# Altium schematic sheet 03_Incense_4G.SchDoc
size B; SheetNumber: 3
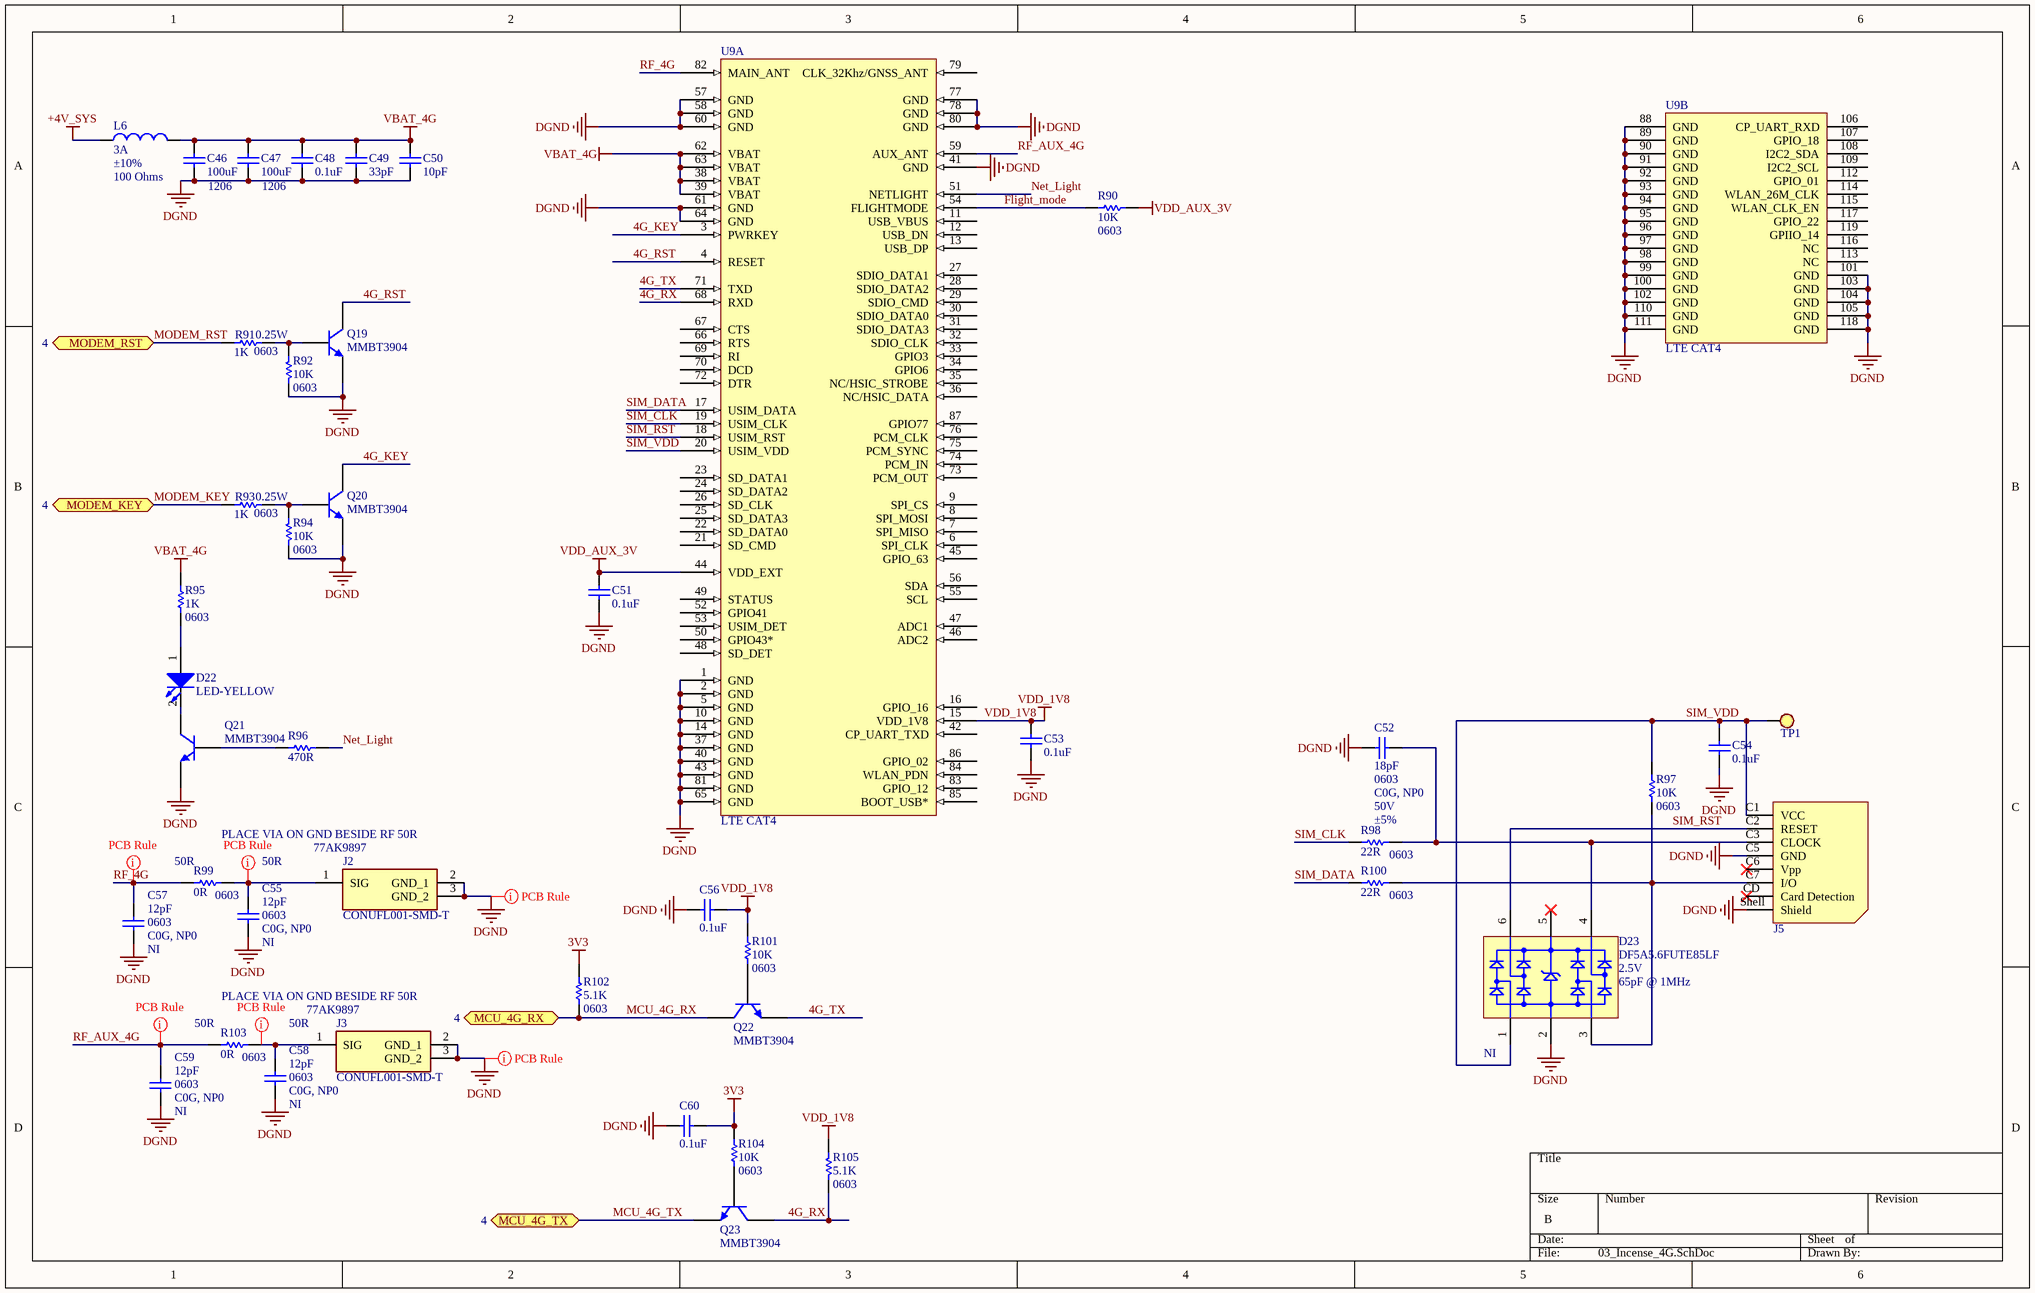
[diagram p0: 03_Incense_4G.SchDoc]

## Parts
C46  PCB FOOTPRINT: 1206  [CAP 1206]  (hidden comment: 100uF)
C47  PCB FOOTPRINT: 1206  [CAP 1206]  (hidden comment: 100uF)
C48  0.1uF  [CAP 0603]
C49  33pF  [CAP 0603]
C50  10pF  [CAP 0603]
C51  0.1uF  [CAP 0603]
C52  FOOTPRINT: 0603  Material: C0G, NP0  Voltage: 50V  Tolerance: ±5%  [CAP 0603]  (hidden comment: 18pF)
C53  0.1uF  [CAP 0603]
C54  0.1uF  [CAP 0603]
C55  value 12pF  FOOTPRINT: 0603  Material: C0G, NP0  [CAP 0603]  (hidden comment: NI)
C56  0.1uF  [CAP 0603]
C57  value 12pF  FOOTPRINT: 0603  Material: C0G, NP0  [CAP 0603]  (hidden comment: NI)
C58  value 12pF  FOOTPRINT: 0603  Material: C0G, NP0  [CAP 0603]  (hidden comment: NI)
C59  value 12pF  FOOTPRINT: 0603  Material: C0G, NP0  [CAP 0603]  (hidden comment: NI)
C60  0.1uF  [CAP 0603]
D22  LED-YELLOW  [LED 0603]
D23  DF5A5.6FUTE85LF  VOLTAGE: 2.5V  CAPACITANCE: 65pF @ 1MHz  NI_MARK: NI  [SC-70-6]
J2  CONUFL001-SMD-T  Supplier Part Number 1: 77AK9897  [CONUFL001-SMD]
J3  CONUFL001-SMD-T  Supplier Part Number 1: 77AK9897  [CONUFL001-SMD]
J5  693021020811  [693021020811]  (value not drawn)
L6  value 100 Ohms  Current: 3A  Tolerance: ±10%  [FB 0603]  (hidden comment: MPZ1608S101ATAH0)
Q19  MMBT3904  [SOT-23]
Q20  MMBT3904  [SOT-23]
Q21  MMBT3904  [SOT-23]
Q22  MMBT3904  [SOT-23]
Q23  MMBT3904  [SOT-23]
R90  PCB Footprint: 0603  [res 0603]  (hidden comment: 10K)
R91  PCB Footprint: 0603  Power: 0.25W  [res 0603]  (hidden comment: 1K)
R92  PCB Footprint: 0603  [res 0603]  (hidden comment: 10K)
R93  PCB Footprint: 0603  Power: 0.25W  [res 0603]  (hidden comment: 1K)
R94  PCB Footprint: 0603  [res 0603]  (hidden comment: 10K)
R95  PCB Footprint: 0603  [res 0603]  (hidden comment: 1K)
R96  470R  [res 0603]
R97  PCB Footprint: 0603  [res 0603]  (hidden comment: 10K)
R98  PCB Footprint: 0603  [res 0603]  (hidden comment: 22R)
R99  PCB Footprint: 0603  [res 0603]  (hidden comment: 0R)
R100  PCB Footprint: 0603  [res 0603]  (hidden comment: 22R)
R101  PCB Footprint: 0603  [res 0603]  (hidden comment: 10K)
R102  PCB Footprint: 0603  [res 0603]  (hidden comment: 5.1K)
R103  PCB Footprint: 0603  [res 0603]  (hidden comment: 0R)
R104  PCB Footprint: 0603  [res 0603]  (hidden comment: 10K)
R105  PCB Footprint: 0603  [res 0603]  (hidden comment: 5.1K)
TP1  TP SMD  [TESTPOINT]  (value not drawn)  (no BOM)
U9  LTE CAT4  [SIM7600C_L1]  (parts A,B of 2)

## Ports
MCU_4G_RX (bidir, see 4), MCU_4G_TX (bidir, see 4), MODEM_KEY (bidir, see 4), MODEM_RST (bidir, see 4)

## Nets
3V3: C60.2 R102.1 R104.1
+4V_SYS: L6.1
DGND: C46.2 C47.2 C48.2 C49.2 C50.2 C51.2 C52.2 C53.2 C54.2 C55.2 C56.2 C57.2 C58.2 C59.2 C60.1 D23.2(GND) J2.2(GND_1) J2.3(GND_2) J3.2(GND_1) J3.3(GND_2) J5.C5(GND) J5.Shell(Shield) Q19.2(E) Q20.2(E) Q21.2(E) R92.2 R94.2 U9.1(GND) U9.2(GND) U9.5(GND) U9.10(GND) U9.14(GND) U9.37(GND) U9.40(GND) U9.41(GND) U9.43(GND) U9.57(GND) U9.58(GND) U9.60(GND) U9.61(GND) U9.64(GND) U9.65(GND) U9.77(GND) U9.78(GND) U9.80(GND) U9.81(GND) U9.88(GND) U9.89(GND) U9.90(GND) U9.91(GND) U9.92(GND) U9.93(GND) U9.94(GND) U9.95(GND) U9.96(GND) U9.97(GND) U9.98(GND) U9.99(GND) U9.100(GND) U9.101(GND) U9.102(GND) U9.103(GND) U9.104(GND) U9.105(GND) U9.110(GND) U9.111(GND) U9.118(GND)
VBAT_4G: C46.1 C47.1 C48.1 C49.1 C50.1 L6.2 R95.2 U9.38(VBAT) U9.39(VBAT) U9.62(VBAT) U9.63(VBAT)
VDD_1V8: C53.1 C56.1 R101.1 R105.1 U9.15(VDD_1V8)
VDD_AUX_3V: C51.1 R90.1 U9.44(VDD_EXT)
4G_KEY: Q20.3(C) U9.3(PWRKEY)
4G_RST: Q19.3(C) U9.4(RESET)
4G_RX: Q23.3(C) R105.2 U9.68(RXD)
4G_TX: Q22.2(E) U9.71(TXD)
Flight_mode: R90.2 U9.54(FLIGHTMODE)
MCU_4G_RX: Q22.3(C) R102.2 ; port MCU_4G_RX
MCU_4G_TX: Q23.2(E) ; port MCU_4G_TX
MODEM_KEY: R93.2 ; port MODEM_KEY
MODEM_RST: R91.2 ; port MODEM_RST
Net_Light: R96.2 U9.51(NETLIGHT)
RF_4G: C57.1 R99.1 U9.82(MAIN_ANT)
RF_AUX_4G: C59.1 R103.1 U9.59(AUX_ANT)
SIM_CLK: R98.1 U9.19(USIM_CLK)
SIM_DATA: R100.1 U9.17(USIM_DATA)
SIM_RST: D23.6(I/O_4) J5.C2(RESET) U9.18(USIM_RST)
SIM_VDD: C54.1 D23.1(I/O_1) J5.C1(VCC) R97.1 TP1.1 U9.20(USIM_VDD)
NetC52_1: C52.1 D23.4(I/O_3) J5.C3(CLOCK) R98.2
NetC55_1: C55.1 J2.1(SIG) R99.2
NetC58_1: C58.1 J3.1(SIG) R103.2
NetD22_1: D22.1(A) R95.1
NetD22_2: D22.2(K) Q21.3(C)
NetD23_3: D23.3(I/O_2) J5.C7(I/O) R97.2 R100.2
NetQ19_1: Q19.1(B) R91.1 R92.1
NetQ20_1: Q20.1(B) R93.1 R94.1
NetQ21_1: Q21.1(B) R96.1
NetQ22_1: Q22.1(B) R101.2
NetQ23_1: Q23.1(B) R104.2

Not connected (* = marked no-connect by the designer): D23 5(VBUS)*; J5 C6(Vpp)* CD(Card_Detection)*; U9 6(SPI_CLK) 7(SPI_MISO) 8(SPI_MOSI) 9(SPI_CS) 11(USB_VBUS) 12(USB_DN) 13(USB_DP) 16(GPIO_16) 21(SD_CMD) 22(SD_DATA0) 23(SD_DATA1) 24(SD_DATA2) 25(SD_DATA3) 26(SD_CLK) 27(SDIO_DATA1) 28(SDIO_DATA2) 29(SDIO_CMD) 30(SDIO_DATA0) 31(SDIO_DATA3) 32(SDIO_CLK) 33(GPIO3) 34(GPIO6) 35(NC/HSIC_STROBE) 36(NC/HSIC_DATA) 42(CP_UART_TXD) 45(GPIO_63) 46(ADC2) 47(ADC1) 48(SD_DET) 49(STATUS) 50(GPIO43*) 52(GPIO41) 53(USIM_DET) 55(SCL) 56(SDA) 66(RTS) 67(CTS) 69(RI) 70(DCD) 72(DTR) 73(PCM_OUT) 74(PCM_IN) 75(PCM_SYNC) 76(PCM_CLK) 79(CLK_32Khz/GNSS_ANT) 83(GPIO_12) 84(WLAN_PDN) 85(BOOT_USB*) 86(GPIO_02) 87(GPIO77) 106(CP_UART_RXD) 107(GPIO_18) 108(I2C2_SDA) 109(I2C2_SCL) 112(GPIO_01) 113(NC) 114(WLAN_26M_CLK) 115(WLAN_CLK_EN) 116(NC) 117(GPIO_22) 119(GPIIO_14)

## Layout directives
rule Undefined; TRACE: 50R: NetC55_1, NetC58_1, RF_4G, RF_AUX_4G
rule Undefined; LAYOUT: PLACE VIA ON GND BESIDE RF 50R: DGND

## Library data of the parts
C46 C47 = Cap: CAP CER 100UF 6.3V X5R 1206; MANUFACTURER1: Taiyo Yuden; MANUFACTURER1_PART#: JMK316BJ107ML-T; MANUFACTURER2_PART#: JMK107BJ475KA-T; Unit: PCS; PACKING: Tape & Reel (TR); Process Type: SM; Tolerance: ±10%; CATEGORY: CAP-CER; VALUE: 100uF; Material: X5R; Voltage: 6.3V; MANUFACTURER2: Yageo
C48 C51 C53 C54 C56 C60 = Cap: CAP-CER,SMD;0.1UF,10%,50V,X7R,0603; MANUFACTURER1: Samsung Electro-Mechanics; MANUFACTURER1_PART#: CL10B104KB8NNNC; MANUFACTURER2_PART#: M0603X104K050TAX; MANUFACTURER1: SS; Unit: PCS; PACKING: Tape & Reel (TR); PCB FOOTPRINT: 0603; Process Type: SM; CATEGORY: CAP-CER; VALUE: 0.1uF; FOOTPRINT: 0603; Material: X7R; Voltage: 50V; Tolerance: ±10%; MANUFACTURER2: UWA
C49 = Cap: CAP CER 33PF 50V C0G/NPO 0603; MANUFACTURER1: Samsung Electro-Mechanics; MANUFACTURER1_PART#: CL10C330JB8NNNC; MANUFACTURER2_PART#: CC0603JRNPO9BN330; Unit: PCS; PACKING: Tape & Reel (TR); PCB FOOTPRINT: 0603; Process Type: SM; Tolerance: ±10%; CATEGORY: CAP-CER; VALUE: 33pF; FOOTPRINT: 0603; Material: C0G/NPO; Voltage: 50V; MANUFACTURER2: Yageo
C50 = Cap: CAP CER 10PF 50V C0G/NPO 0603; MANUFACTURER1: Samsung Electro-Mechanics; MANUFACTURER1_PART#: CL10C100JB8NNNC; MANUFACTURER2_PART#: CC0603JRNPO9BN100; Unit: PCS; Material: X7R; PACKING: Tape & Reel (TR); PCB FOOTPRINT: 0603; Process Type: SM; Tolerance: ±10%; CATEGORY: CAP-CER; VALUE: 10pF; FOOTPRINT: 0603; Voltage: 50V; MANUFACTURER2: Yageo
C52 = Cap: CAP CER 18PF 50V C0G/NP0 0603; MANUFACTURER1: Samsung; MANUFACTURER1_PART#: CL10C180JB81PNC; MANUFACTURER2_PART#: CC0603JRNPO9BN180; Unit: PCS; PACKING: Tape & Reel (TR); Process Type: SM; CATEGORY: CAP-CER; VALUE: 18pF; PCB FOOTPRINT: 0603; MANUFACTURER2: Yageo
C55 C57-C59 = Cap: CAP-CER,SMD;12PF,5%,50V,C0G/NPO 0603; MANUFACTURER1: Yageo; MANUFACTURER1_PART#: CC0603JRNPO9BN120; Unit: PCS; PACKING: Tape & Reel (TR); Process Type: SM; CATEGORY: CAP-CER; NI_MARK: NI; Voltage: 50V; PCB FOOTPRINT: 0603; Tolerance: ±5%
D22 = LED-RED: LED-SMD,2V,20mA,0603,RED; MANUFACTURER1: OSRAM; MANUFACTURER2_PART#: LTST-S270KSKT; MANUFACTURER1_PART#: LY Q396-P1Q2-36; PACKING: Tape & Reel (TR); PCB Footprint: 0603; Process Type: SM; Unit: PCS; Value: LED RED; Category: LED SMD; MANUFACTURER2: Lite-On Inc.
D23 = DIODES 5v TVS SOT-23-6: 2.5V TVS DIODE SOT23-6; MANUFACTURER1: Toshiba; MANUFACTURER1_PART#: DF5A5.6FUTE85LF; MANUFACTURER2: *; MANUFACTURER2_PART#: *; LOH_CODE: *; Value: DF5A5.6FUTE85LF; Category: TVS; CURRENT: *; POWER: *
J2 J3 = CONUFL001-SMD-T: RF Connectors / Coaxial Connectors T&R U.FL Straight Surface Mount Jack; MANUFACTURER1: Linx Technologies; MANUFACTURER2_PART#: 712-CONUFL001-SMD-T; Datasheet Link: https://linxtechnologies.com/wp/product/mhf-rf-connectors/; MANUFACTURER1_PART#: CONUFL001-SMD-T; MANUFACTURER2: TE Connectivity / Linx Technologies; Supplier 1: Newark
J5 = 693021020811: WR-CRD_SMT_MICROSIM_PUSH&PUSH_CD; Manufacturer: Wurth Elektronik; Match Code: WR-CRD; Contact Resistance: 100mOhm; Gender: Receptacle; Rated Current: 0.5A; Working Voltage: 50VAC; Withstanding Voltage: 500VAC; Manufacturer Part Number: 693021020811; Category: Input/Output Connectors; ComponentLink1Description: Website Link; ComponentLink1URL: https://www.we-online.com/redexpert/article/693021020811?ad; ComponentLink2Description: Datasheet Link; ComponentLink2URL: https://www.we-online.com/redexpert/spec/693021020811?ad; Mount: Surface Mount; Operating Temperature Max: 70°C; Operating Temperature Min: -20°C; Packaging: Tape and Reel; Number of Pins: 6; Type: Push & Push; MANUFACTURER1: Wurth Elektronik; MANUFACTURER1_PART#: 693021020811
L6 = inductor 2.2uF: FERRITE BEAD 100 OHM 0603 1LN; MANUFACTURER1: TDK Corporation; MANUFACTURER2_PART#: BLM18KG101TN1D; PACKING: Tape & Reel (TR); PCB Footprint: 0603; Process Type: SM; Unit: PCS; Category: Inductor; MANUFACTURER1_PART#: MPZ1608S101ATAH0; MANUFACTURER2: Murata Electronics
Q19-Q23 = NPN: NPN 200mA 40V 350mW SOT-23 Transistors; MANUFACTURER1: Guangdong Hottech; PROCESS_TYPE: SM; PACKAGE: SOT23; Category: TRANSISTOR; MANUFACTURER2: HT(Shenzhen Jinyu Semicon); MANUFACTURER2_PART#: MMBT3904; MANUFACTURER1_PART#: MMBT3904; Value: MMBT3904
R90 R92 R94 R97 R101 R104 = Res0.3: RES SMD,10K OHM 5% 1/10W 0603; MANUFACTURER1: Stackpole Electronics Inc; MANUFACTURER1_PART#: RMCF0603JT10K0; MANUFACTURER2_PART#: R0603J10KKDX; PACKING: Tape & Reel (TR); Process Type: SM; Unit: PCS; Power: 0.25W; Value: 10K; CATEGORY: RES-SMD; MANUFACTURER2: UWA; Tolerance: ±5%
R91 R93 R95 = Res0.3: RES SMD,1K OHM,5%,1/10W,0603; MANUFACTURER1: Stackpole Electronics Inc; MANUFACTURER1_PART#: RMCF06031K00JNEAC; MANUFACTURER2_PART#: R0603J1KTG; DESCCRIPTION: RES SMD 1K OHM 5% 1/10W 0603; PACKING: Tape & Reel (TR); Process Type: SM; Unit: PCS; LOH_Code: 140100083; Value: 1K; CATEGORY: RES SMD; MANUFACTURER2: UWA
R96 = Res0.3: RES SMD, 470 OHM 5% 1/8W 0603; MANUFACTURER1: KOA Speer Electronics, Inc.; MANUFACTURER1_PART#: RK73B1JTTD471J; MANUFACTURER2_PART#: RMCF0603JT470R; PACKING: Tape & Reel (TR); PCB Footprint: 0603; Process Type: SM; Unit: PCS; Power: 0.25W; Value: 470R; CATEGORY: RES SMD; MANUFACTURER2: Stackpole; Tolerance: ±5%
R98 R100 = Res0.3: RES 22 OHM 5% 1/10W 0603; MANUFACTURER1: Yageo; MANUFACTURER1_PART#: RC0603JR-0722RL; MANUFACTURER2_PART#: RMCF0603JT22R0; PACKING: Tape & Reel (TR); Process Type: SM; Unit: PCS; Power: 0.25W; Value: 22R; CATEGORY: RES SMD; MANUFACTURER2: Stackpole Electronics Inc; Tolerance: 5%
R99 R103 = Res0.3: RES SMD 0 OHM JUMPER 1/10W 0603; MANUFACTURER1: Yageo; MANUFACTURER1_PART#: RC0603JR-070RL; MANUFACTURER2_PART#: RMCF0603ZT0R00; PACKING: Tape & Reel (TR); Process Type: SM; Unit: PCS; Power: 0.25W; Tolerance: 5%; Value: 0R; CATEGORY: RES SMD; MANUFACTURER2: Stackpole Electronics Inc
R102 R105 = Res0.3: RES SMD 5.1K OHM 1% 1/10W 0603; MANUFACTURER1: Yageo; MANUFACTURER1_PART#: RC0603FR-075K1L; PACKING: Tape & Reel (TR); Process Type: SM; Unit: PCS; Value: 5.1K; CATEGORY: RES SMD
TP1 = TP SMD: TEST POINT
U9 = SIM7600C_L1: MODULE 4G SIM7600C_L1; MANUFACTURER1: SIMCOM; MANUFACTURER1_PART#: A7600C-L1